# EAGLE design ComponentCounterLeds (EAGLE 7.4.0)
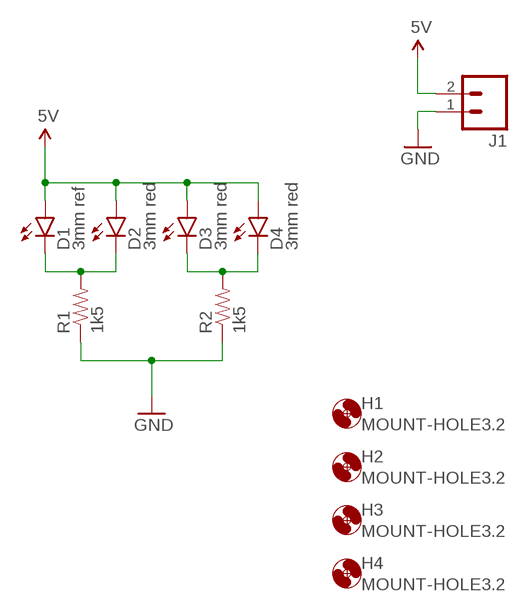
[diagram p0: schematic, sheet 1]

## Parts
D1  3mm ref  LED-3MM-NO_SILK  [LED3MM-NS]
D2  3mm red  LED-3MM-NO_SILK  [LED3MM-NS]
D3  3mm red  LED-3MM-NO_SILK  [LED3MM-NS]
D4  3mm red  LED-3MM-NO_SILK  [LED3MM-NS]
H1  MOUNT-HOLE3.2  [3,2]
H2  MOUNT-HOLE3.2  [3,2]
H3  MOUNT-HOLE3.2  [3,2]
H4  MOUNT-HOLE3.2  [3,2]
J1  M02-JST-2MM-SMT  [JST-2-SMD]
R1  1k5  RESISTOR1206  [1206]
R2  1k5  RESISTOR1206  [1206]

## Nets
5V: D1.A D2.A D3.A D4.A J1.2
GND: J1.1 R1.1 R2.1
N$1: D1.K(C) D2.K(C) R1.2
N$2: D3.K(C) D4.K(C) R2.2

## Library data of the parts
D1-D4 = SparkFun-LED:LED: LEDs Standard schematic elements and footprints for 5mm, 3mm, 1206, and 0603 sized LEDs. 5mm - Spark Fun Electronics SKU : COM-00529 (and others)
H1-H4 = holes:MOUNT-HOLE: MOUNTING HOLE with drill center marker
J1 = SparkFun-Connectors:M02: Standard 2-pin 0.1" header. Use with - straight break away headers ( PRT-00116) - right angle break away headers (PRT-00553) - swiss pins (PRT-00743) - machine pins (PRT-00117) - female headers (PRT-00115) Molex polarized connector foot print use with: PRT-08233 with associated crimp pins and housings. 2.54_SCREWTERM for use with PRT-10571. 3.5mm Screw Terminal footprints for PRT-08084 5mm Screw Terminal footprints for use with PRT-08432; FARNELL: 9492615; PROD_ID: CONN-11443
R1 R2 = SparkFun-Resistors:RESISTOR: Resistor Basic schematic elements and footprints for 0603, 1206, and PTH resistors.

## Board
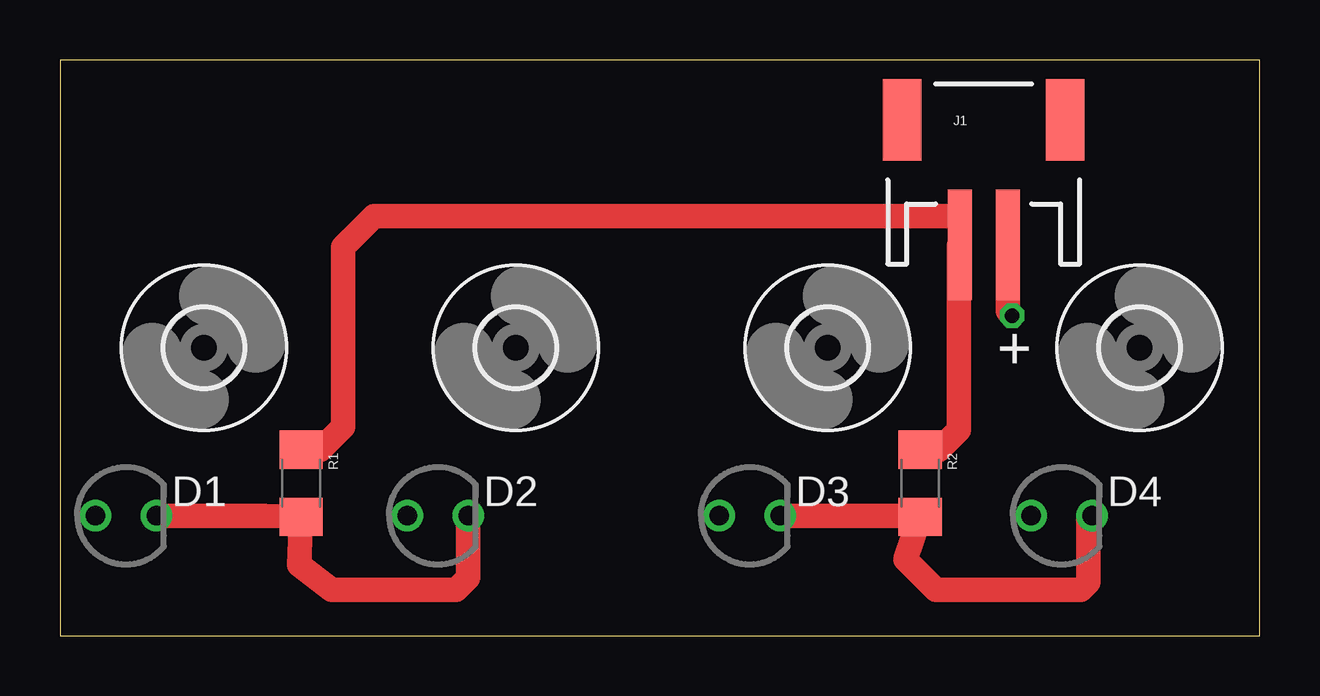
[diagram p1: board, top side]
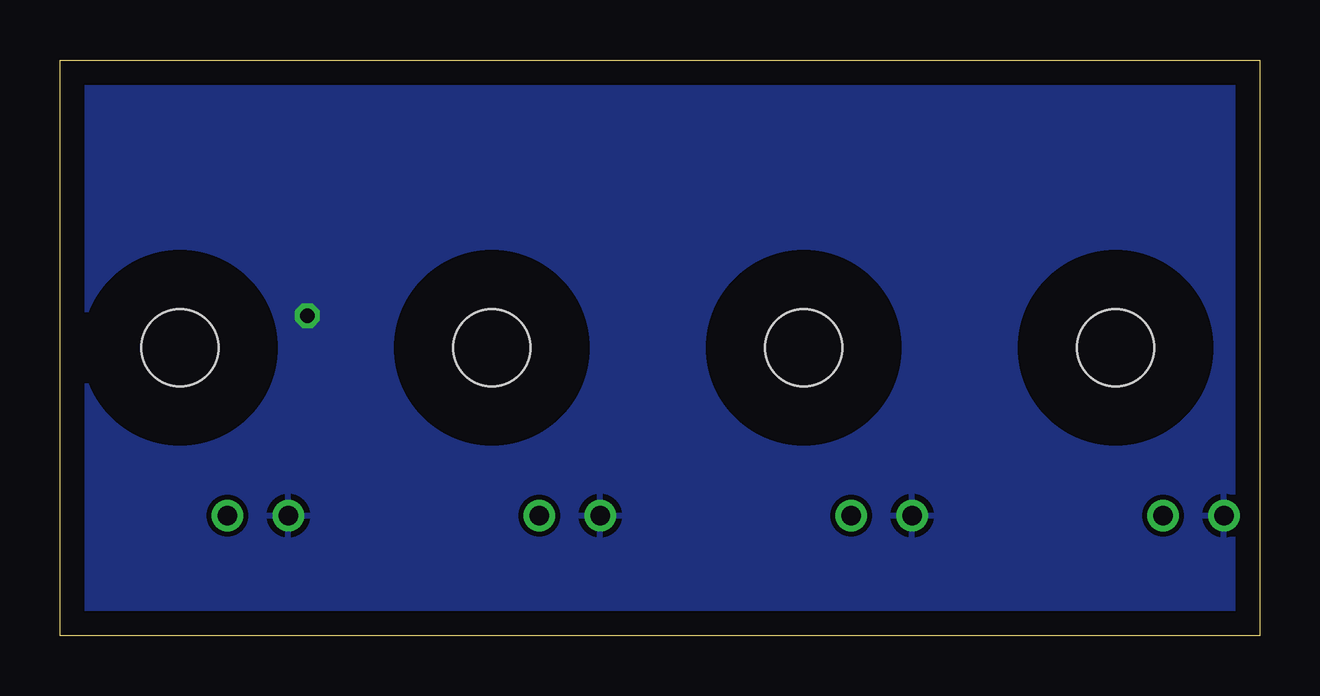
[diagram p2: board, bottom side, seen from below]

Size 50 x 24 mm. Coordinates in mm from the lower left corner, seen from the top.
Outline: 0,0 50,0 50,24 0,24 0,0
Copper layers (1*16): Top 0.035mm / dielectric 1.5mm / Bottom 0.035mm
Design rules "default": minimum track width 10mil, minimum drill 24mil, track to track 8mil, track to pad 8mil, pad to pad 8mil, via to via 8mil, smd to smd 8mil, copper to edge 40mil, drill to drill 8mil, minimum pad ring 10mil, minimum via ring 8mil, stop-mask expansion 4mil, vias tented up to drill 0mil, thermal gap 10mil

### Footprints (pad centres in the part's own frame; a part is rotated, then mirrored left to right if it is on the bottom)
LED3MM-NS = drill 0.813: A -1.27,0; K 1.27,0
3,2 = hole 3.2: 0,0
JST-2-SMD = smd 1 x 4.6: 1 -1,-3.7; 2 1,-3.7 | smd 1.6 x 3.4: NC1 -3.4,1.5; NC2 3.4,1.5
1206 = smd 1.6 x 1.8: 1 -1.4,0; 2 1.4,0

### Placement (x,y rotation side)
D1  2.75,5 0 top
D2  15.75,5 0 top
D3  28.75,5 0 top
D4  41.75,5 0 top
H1  6,12 0 top
H2  19,12 0 top
H3  32,12 0 top
H4  45,12 0 top
J1  38.5,20 0 top
R1  10.05,6.35 270 top
R2  35.85,6.35 270 top

### Tracks (layer width: path | path; a pad name or v marks a point on that pad's centre or on a via)
5V  (via drill 0.6)
  Top 1.016: J1.2 39.5,13.52 v39.69,13.34
  pour Bottom: -0.5,24.13 -0.5,0 50.16,0 50.16,24.13
GND
  Top 1.016: R2.1 36.64,7.75 37.47,8.57 37.47,16.27 J1.1 37.5,17.4 37.4,17.5 13.1,17.5 11.8,16.2 11.8,8.7 10.85,7.75 R1.1
N$1
  Top 1.016: D1.K 8.52,5 R1.2 9.97,2.96 11.32,1.91 16.51,1.91 17.02,2.42 D2.K
N$2
  Top 1.016: D3.K 35.19,5 R2.2 35.24,3.17 36.51,1.91 42.55,1.91 42.86,2.22 42.86,4.84 D4.K

### Text on the board
tNames: +
Measures: 7mm between LED and screw hole | 3.75mm offset from left hand edge | LED is 3.75mm offset from left hand edge | 0 is 0.5mm from left hand edge, so led is 3.25 from zero | screw is 6.5 from left, so 6.0 from 0 | Unit repeats every 13mm